# EAGLE design CANBed-FD M4 (EAGLE 6.4)
DESCRIPTION: microOBD 200 OBD-II Module; HW_REV: 1.4; PCB_REV: C; PCB_SPEC1: Layer Count: 4; PCB_SPEC2: Size: 1.3" x 0.59"; PCB_SPEC3: Finish Thickness: 0.049" - 0.052"; PCB_SPEC4: Copper Weight: 1oz; TITLE: STM1120

## Sheet 1 of 2
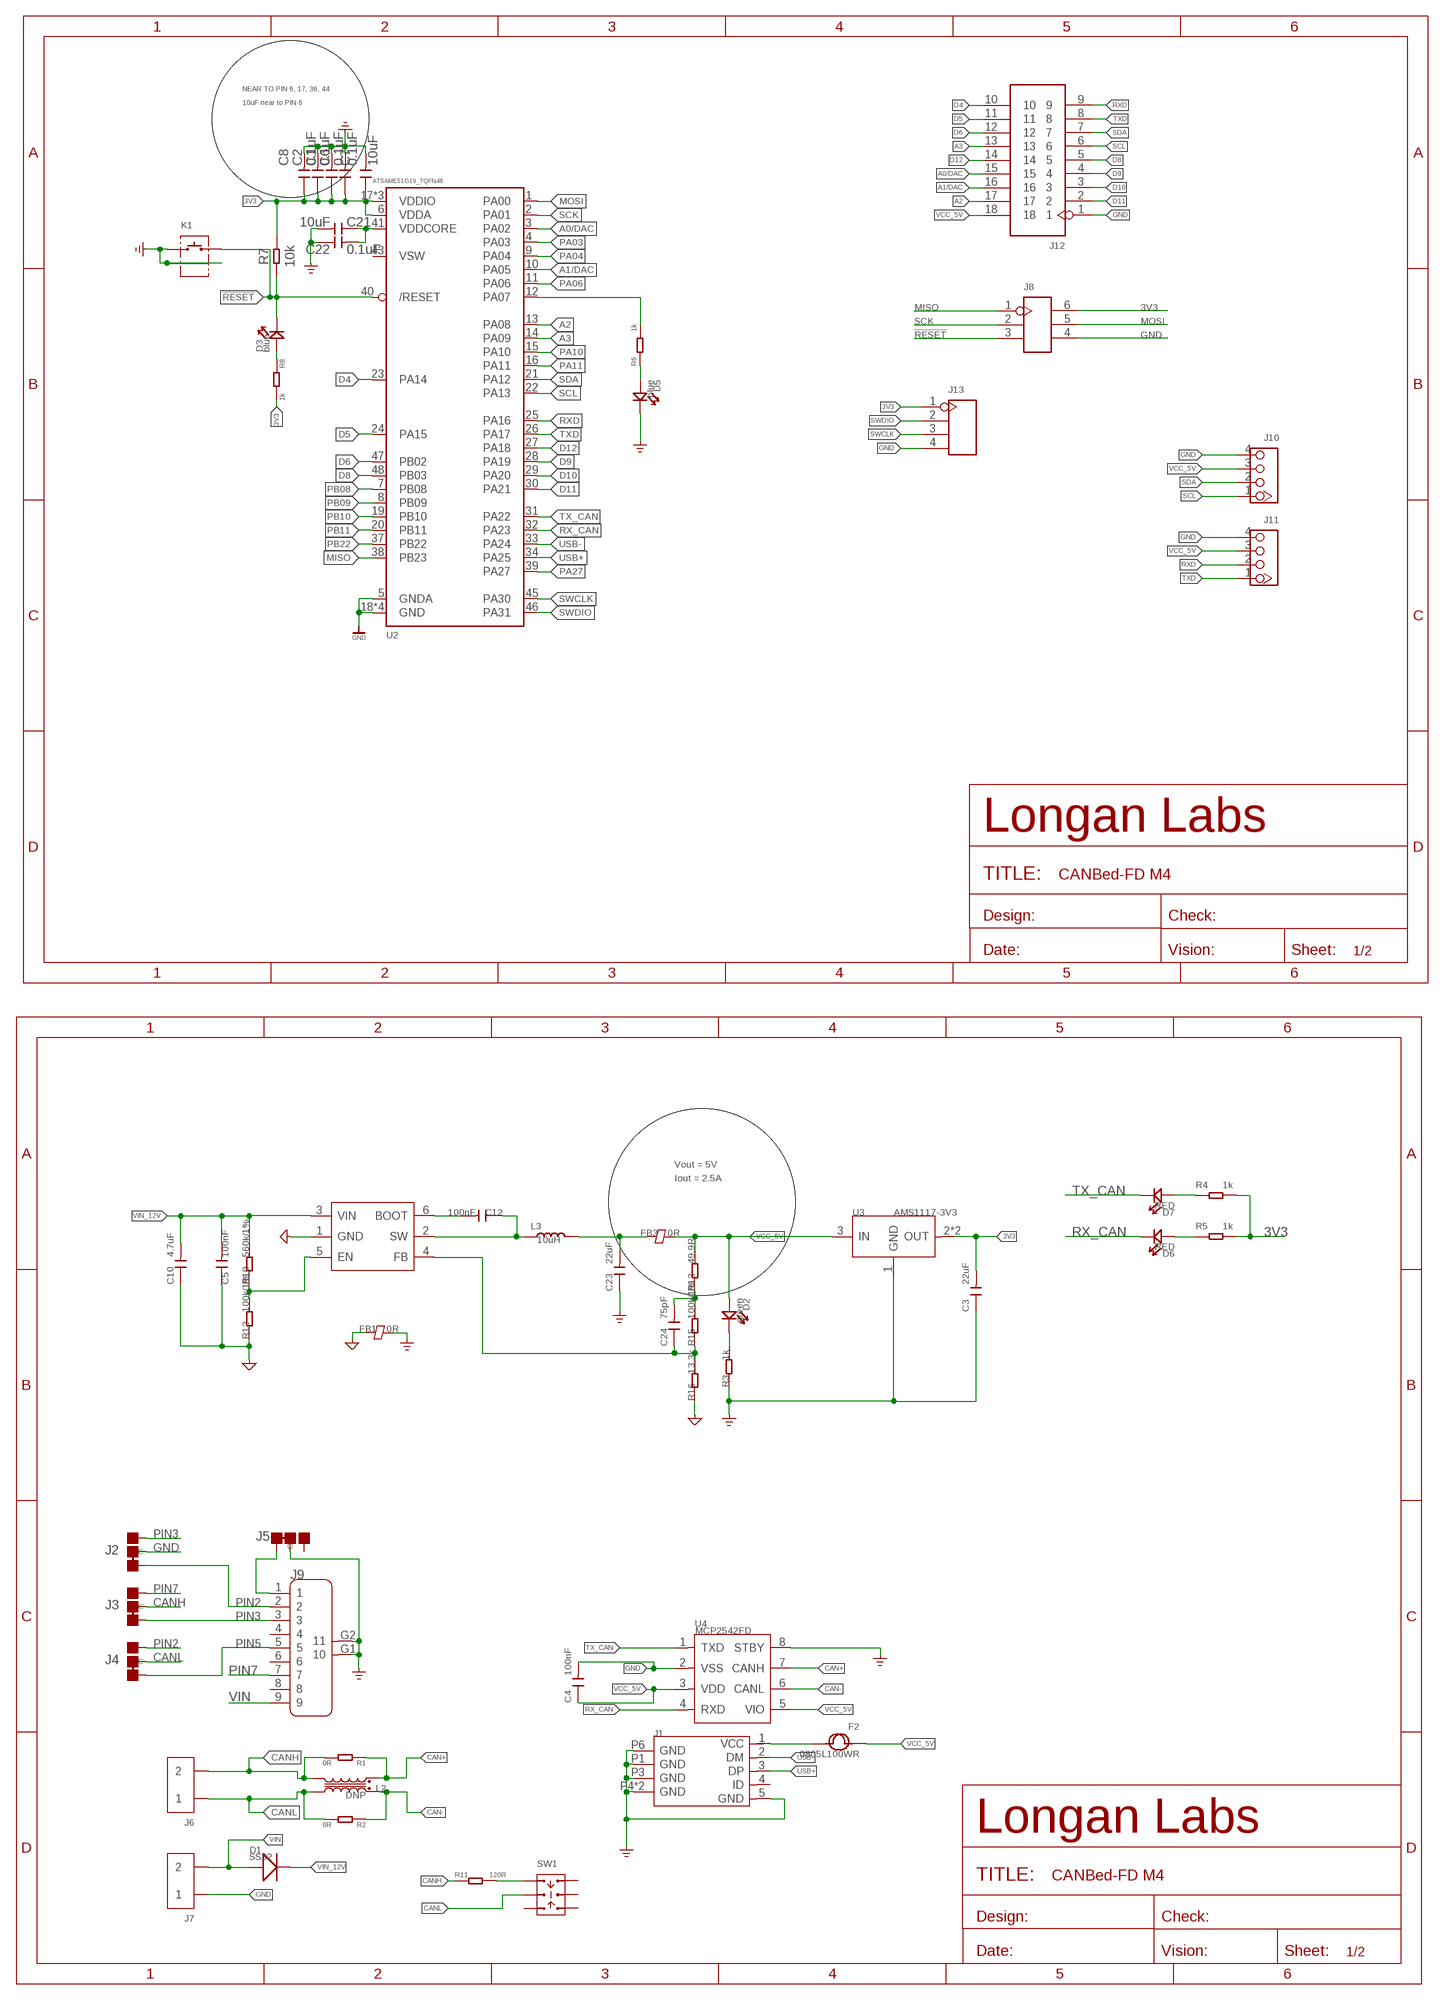
[diagram p0: schematic, sheet 1]

### Parts
C1  0.1uF  CAP-0603  [C0603]
C2  0.1uF  CAP-0603  [C0603]
C3  22uF  CAP-1206  [C1206]
C4  100nF  CAP-0603  [C0603]
C5  100nF  CAP-0603  [C0603]
C6  0.1uF  CAP-0603  [C0603]
C7  10uF  CAP-0603  [C0603]
C8  0.1uF  CAP-0603  [C0603]
C10  4.7uF  CAP-1206  [C1206]
C12  100nF  CAP-0603  [C0603]
C21  0.1uF  CAP-0603  [C0603]
C22  10uF  CAP-0603  [C0603]
C23  22uF  CAP-1206  [C1206]
C24  75pF  CAP-0603  [C0603]
D1  SS32  DIODE'SMA'  [DO-214AC]
D2  green  LED'0603'  [LED-0603]
D3  blue  LED'0603'  [LED-0603]
D5  blue  LED'0603'  [LED-0603]
D6  RED  LED'0603'  [LED-0603]
D7  RED  LED'0603'  [LED-0603]
F2  0805L100WR  FUSE0805  [F0805]
FB1  0R  FERRITE-BEAD-0805  [F0805]
FB3  0R  FERRITE-BEAD-0805  [F0805]
J1  MICRO-USB5+4P-320010050  [MICRO-USB5+5P-SMD-0.65-7.2X5.06MM]
J2  JUMPER-3P-SHORT  [3P-SMD-SHORT]
J3  JUMPER-3P-SHORT  [3P-SMD-SHORT]
J4  JUMPER-3P-SHORT  [3P-SMD-SHORT]
J5  JUMPER-3P-SHORT  [3P-SMD-SHORT]
J6  SCREW-TERMINAL-2P'5.08'  [H2-5.0-10.5X8.0MM]
J7  SCREW-TERMINAL-2P'5.08'  [H2-5.0-10.5X8.0MM]
J8  HEADER-2X3P-2.54  [H2X3-2.54]
J9  DB9'MEAL'  [DB9-MEAL]
J10  320110033  GROVE-CONNECTOR-DIP-2.0  [HW4-2.0]
J11  320110033  GROVE-CONNECTOR-DIP-2.0  [HW4-2.0]
J12  HEADER-2X9P-2.54  [H2X9-2.54]
J13  HEADER-4P-65/35MIL  [H4-2.54]
K1  BUTTON-2+2P  [SW2+2P-7.7X2.75X3.95MM]
L2  DNP  INDUCTOR-COMMON-MODE-SRF2012-900YA  [INT4-0.85-2X1.25X1.2MM]
L3  10uH  INDUCTOR-6.6X7.1  [INT2-SMD-6.6X7.1X3MM]
R1  0R  RES-0603  [R0603]
R2  0R  RES-0603  [R0603]
R3  1k  RES-0603  [R0603]
R4  1k  RES-0603  [R0603]
R5  1k  RES-0603  [R0603]
R6  1k  RES-0603  [R0603]
R7  10k  RES-0603  [R0603]
R8  1k  RES-0603  [R0603]
R10  560k/1%  RES-0603  [R0603]
R11  120R  RES-0603  [R0603]
R12  100k/1%  RES-0603  [R0603]
R13  49.9R  RES-0603  [R0603]
R15  100k/1%  RES-0603  [R0603]
R16  13.3k  RES-0603  [R0603]
SW1  SWITCH-2CH-6P-311010004  [SW6-2.54-9.0X3.5X3.2+2.0MM]
U1  PMIC-TPS54302  [SOT-23-6]
U2  ATSAME51G19_TQFN48  [TQFN48_7MM]
U3  AMS1117-3V3  PMIC-CJ1117S  [SOT-223]
U4  MCP2542FD  TRANSCEIVER-MCP2542  [SOIC8-1.27-5X4MM]

### Nets
3V3: C1.1 C2.1 C3.2 C6.1 C7.1 C8.1 J8.6 J13.1 R4.2 R5.2 R7.2 R8.2 U2.6(VDDA) U2.17(VDDIO) U2.36(VDDIO) U2.44(VDDIO) U3.2(OUT) U3.TER(OUT)
!RESET: D3.- J8.3 K1.2 R7.1 U2.40(/RESET)
A0/DAC: J12.15 U2.3(PA02)
A1/DAC: J12.16 U2.10(PA05)
A2: J12.17 U2.13(PA08)
A3: J12.13 U2.14(PA09)
AGND: C5.1 C10.1 FB1.1 R12.1 R16.1 U1.1(GND) ; supply symbol labelled GND_SIGNAL
CAN+: L2.4 R1.1 U4.7(CANH)
CAN-: L2.1 R2.1 U4.6(CANL)
CANH: J3.MM(C) J6.2 L2.3 R1.2 R11.1
CANL: J4.MM(C) J6.1 L2.2 R2.2 SW1.COM1
D4: J12.10 U2.23(PA14)
D5: J12.11 U2.24(PA15)
D6: J12.12 U2.47(PB02)
D8: J12.5 U2.48(PB03)
D9: J12.4 U2.28(PA19)
D10: J12.3 U2.29(PA20)
D11: J12.2 U2.30(PA21)
D12: J12.14 U2.27(PA18)
EXT_PWR: F2.2 J1.1(VCC)
GND: C1.2 C2.2 C3.1 C4.2 C6.2 C7.2 C8.2 C21.1 C22.2 C23.1 D5.- FB1.2 J1.5(GND) J1.P1(GND) J1.P3(GND) J1.P4(GND) J1.P5(GND) J1.P6(GND) J2.MM(C) J5.MM(C) J7.1 J8.4 J9.G1 J9.G2 J10.4 J11.4 J12.1 J13.4 K1.1 K1.S1 K1.S2 R3.1 U2.5(GNDA) U2.18(GND) U2.35(GND) U2.42(GND) U2.THERMAL(GND) U3.1(GND) U4.2(VSS) U4.8(STBY) ; supply symbol labelled GND_POWER
MISO: J8.1 U2.38(PB23)
MOSI: J8.5 U2.1(PA00)
N$1: D3.+ R8.1
N$2: D7.+ R4.1
N$3: D2.- R3.2
N$4: R10.1 R12.2 U1.5(EN)
N$5: C21.2 C22.1 U2.41(VDDCORE)
N$6: R6.2 U2.12(PA07)
N$8: D5.+ R6.1
N$11: C12.1 L3.1 U1.2(SW)
N$13: J5.11(L) J9.1
N$14: C12.2 U1.6(BOOT)
N$15: D6.+ R5.1
N$16: R11.2 SW1.CH1A
N$19: C23.2 FB3.1 L3.2
N$23: C24.2 R13.1 R15.2
N$26: C24.1 R15.1 R16.2 U1.4(FB)
PA03: U2.4(PA03)
PA04: U2.9(PA04)
PA06: U2.11(PA06)
PA10: U2.15(PA10)
PA11: U2.16(PA11)
PA27: U2.39(PA27)
PB08: U2.7(PB08)
PB09: U2.8(PB09)
PB10: U2.19(PB10)
PB11: U2.20(PB11)
PB22: U2.37(PB22)
PIN2: J2.11(L) J4.00(R) J9.2
PIN3: J2.00(R) J3.11(L) J9.3
PIN5: J4.11(L) J9.5
PIN7: J3.00(R) J9.7
RX_CAN: D6.- U2.32(PA23) U4.4(RXD)
RXD: J11.2 J12.9 U2.25(PA16)
SCK: J8.2 U2.2(PA01)
SCL: J10.1 J12.6 U2.22(PA13)
SDA: J10.2 J12.7 U2.21(PA12)
SWCLK: J13.3 U2.45(PA30)
SWDIO: J13.2 U2.46(PA31)
TX_CAN: D7.- U2.31(PA22) U4.1(TXD)
TXD: J11.1 J12.8 U2.26(PA17)
USB+: J1.3(DP) U2.34(PA25)
USB-: J1.2(DM) U2.33(PA24)
VCC_5V: C4.1 D2.+ F2.1 FB3.2 J10.3 J11.3 J12.18 R13.2 U3.3(IN) U4.3(VDD) U4.5(VIO)
VIN: D1.1(+) J7.2 J9.9
VIN_12V: C5.2 C10.2 D1.2(-) R10.2 U1.3(VIN)
Unconnected: J1.4(ID) J5.00(R) J9.4 J9.6 J9.8 SW1.CH1B SW1.CH2A SW1.CH2B SW1.COM2 U2.43(VSW)

### Notes on the sheet
- NEAR TO PIN 6, 17, 36, 44
- 10uF near to PIN 6
- Vout = 5V
- Iout = 2.5A

## Sheet 2 of 2

## Library data of the parts
C1-C8 C10 C12 C21-C24 = Discrete-new:CAP: Ceramic Capacitors
D1 = Discrete-new:DIODE*
D2 D3 D5-D7 = Discrete-new:LED
F2 = Discrete-small:FUSE
FB1 FB3 = Discrete-new:FERRITE-BEAD
J1 = Connector-new:MICRO-USB5+4P: 320010137:MICRO USB B型DIP 沉板0.7无卷边 -ST-USB-01H2 320010000:MICRO USB 5F CCHT 6.45(0.8X0.9) -ST-USB-001G 320010050:USB-MC-001-05 320010025:MICRO USB 5S AB TYPE DIP7.2
J2-J5 = Discrete-new:JUMPER-3P-SHORT
J6 J7 = Connector-new:SCREW-TERMINAL-2P: 2P-3.5:320110028;2P-5.0:320110031
J8 = Connector-new:HEADER-2X3P
J9 = Connector:DB9
J10 J11 = Connector-new:GROVE-CONNECTOR-DIP: 4P-2.0:320110033;4P-2.0-90D:320110034
J12 = Connector-new:HEADER-2X9P
J13 = Connector-new:HEADER-4P
K1 = Connector-new:BUTTON-2+2P
L2 = Discrete-new:INDUCTOR-COMMON-MODE
L3 = Discrete-new:INDUCTOR
R1-R8 R10-R13 R15 R16 = Discrete-new:RES
SW1 = Switch:SWITCH-2CH-6P
U1 = IC-new:PMIC-TPS54302
U2 = MyLibrary:ATSAME51G19; MPN: ATSAME51G19A-MF
U3 = IC-new:PMIC-CJ*1117: Low Drop Fixed And Adjustable Positive Voltage Regulators http://www.datasheetcatalog.org/datasheet/SGSThomsonMicroelectronics/mXuqtqv.pdf
U4 = untitled:TRANSCEIVER-MCP2542

## Net classes
0 default: width 0.152 mm, drill 0.254 mm, clearance 0.152 mm
1 can: width 0.152 mm, drill 0.254 mm, clearance 0.152 mm
2 USB: width 0.102 mm, clearance 0.076 mm
3 usbvcc: width 0.152 mm, drill 0.152 mm, clearance 0.152 mm

## Board
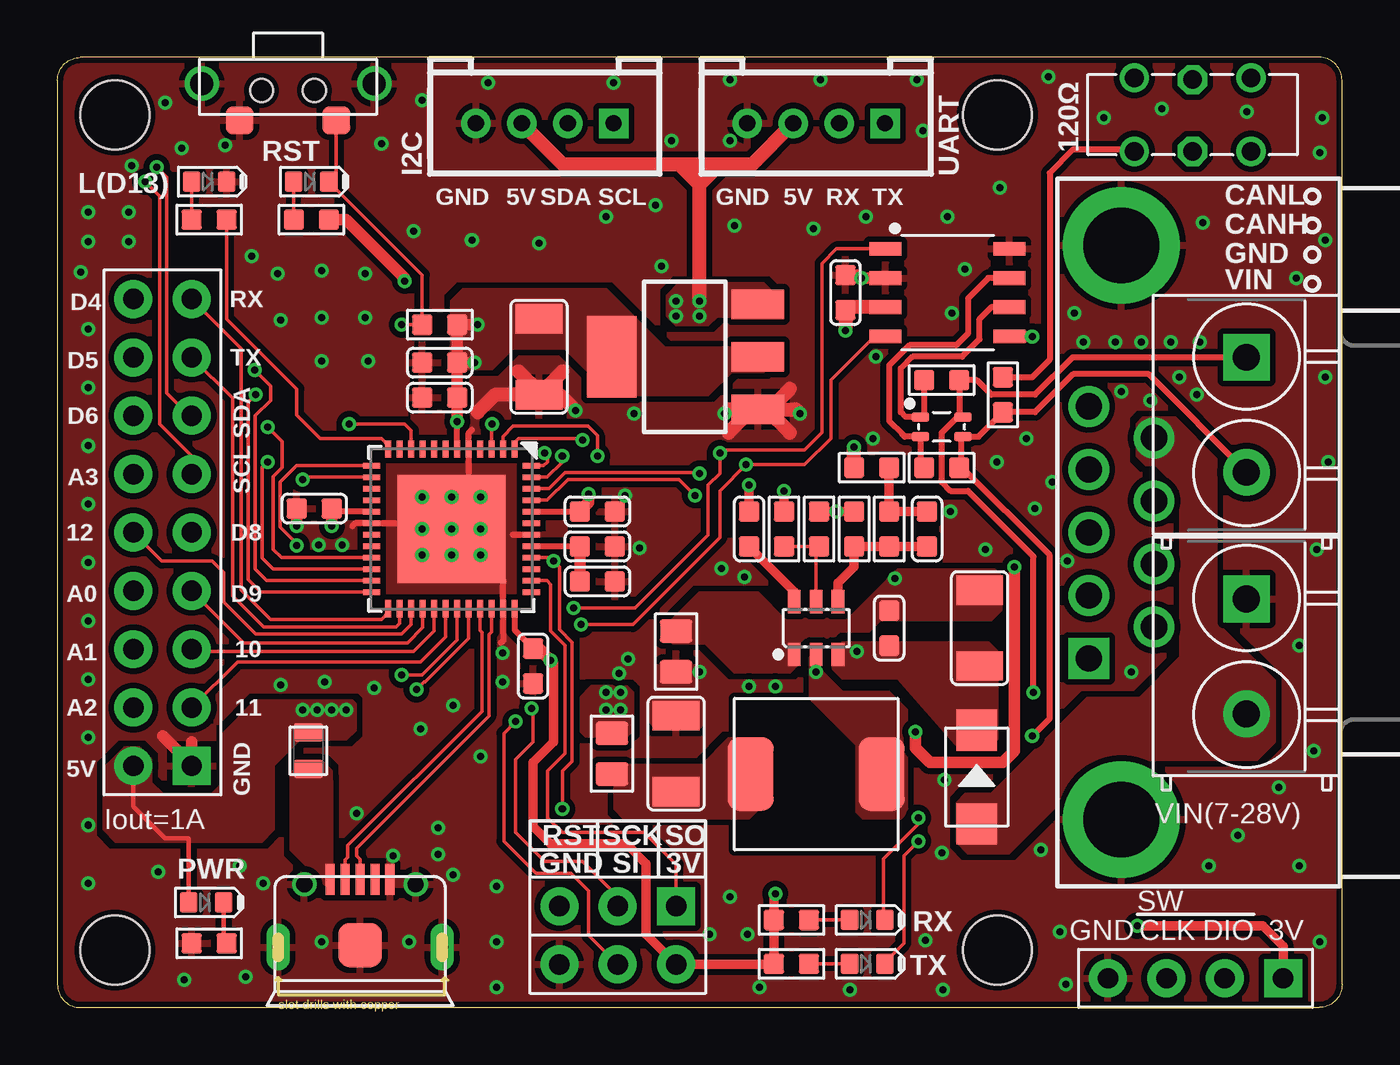
[diagram p1: board, top side]
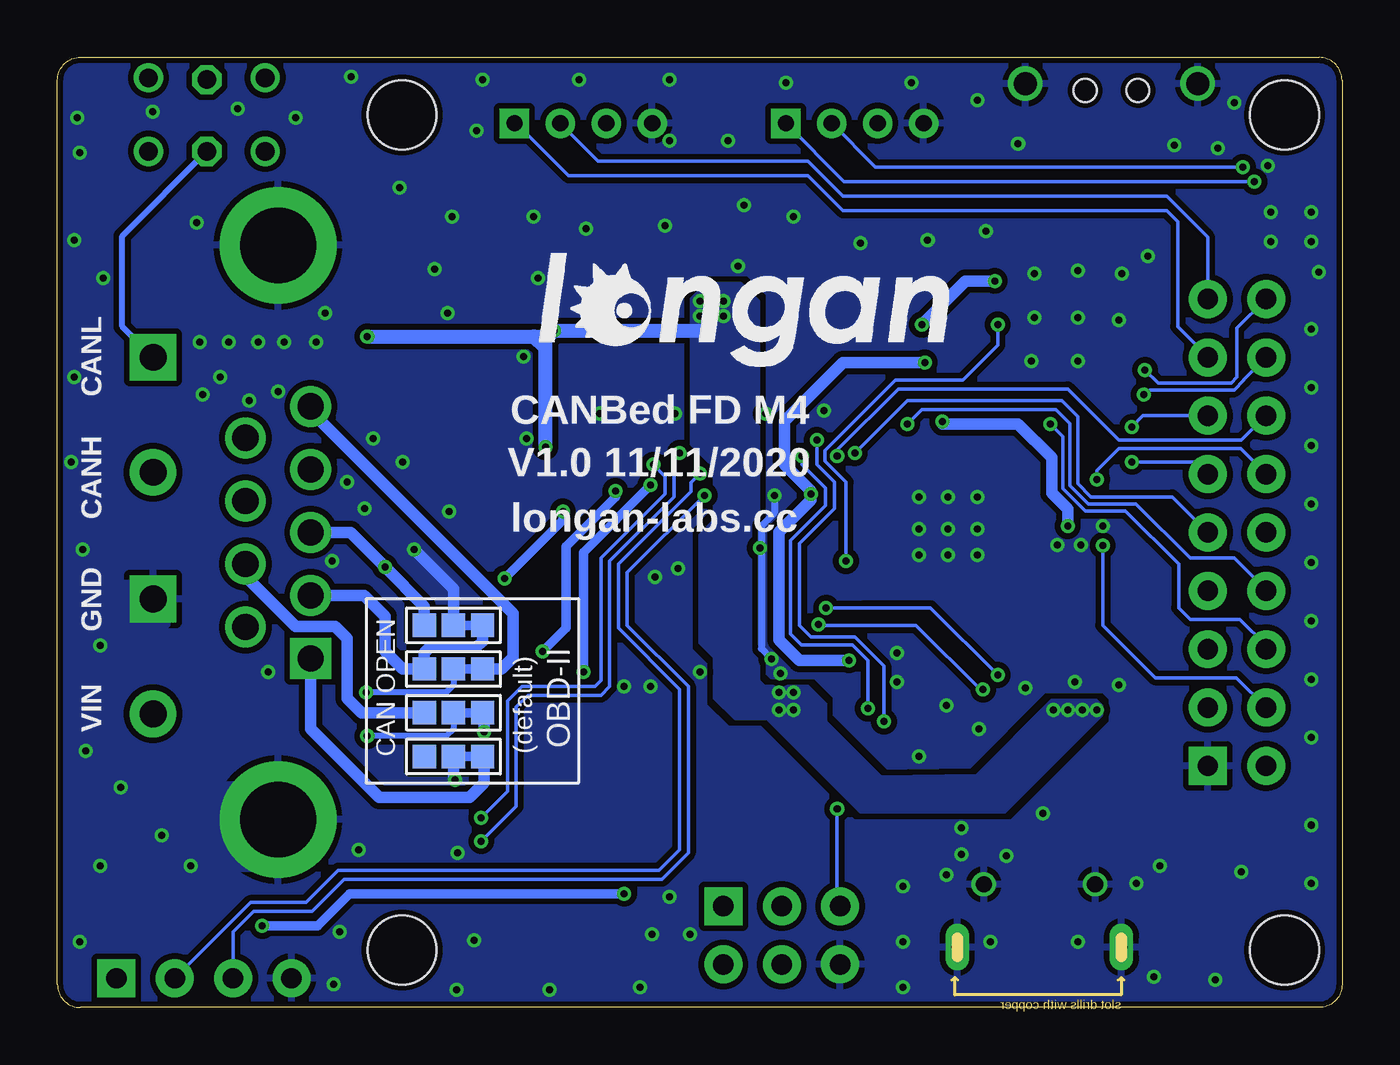
[diagram p2: board, bottom side, seen from below]

Size 55.91 x 41.35 mm. Coordinates in mm from the lower left corner, seen from the top.
Outline: 1,0 54.91,0 arc90 55.91,1 55.91,40.35 arc84 55.01,41.35 1,41.35 arc90 0,40.35 0,1 arc90 1,0
Copper layers (1*16): Top 0.035mm / dielectric 1.5mm / Bottom 0.035mm
Design rules "SeeedStudio_2layer_DRU_no_angle_20140221 *": minimum track width 1mil, minimum drill 10mil, track to track 6mil, track to pad 6mil, pad to pad 6mil, via to via 6mil, smd to smd 0mil, copper to edge 10mil, drill to drill 10mil, minimum pad ring 4mil, minimum via ring 4mil, stop-mask expansion 2mil, vias tented up to drill 25mil, thermal gap 10mil
Holes 3 mm at 2.5,38.85 2.5,2.5 40.91,38.85 40.91,2.5
tRestrict: area 29.5,12.1 to 32.4,13.5; area 29.5,6.9 to 36.6,7.9

### Footprints (pad centres in the part's own frame; a part is rotated, then mirrored left to right if it is on the bottom)
C0603 = smd 0.889 x 0.889: 1 -0.762,0; 2 0.762,0
C1206 = smd 1.27 x 2.032: 1 -1.651,0; 2 1.651,0
DO-214AC = smd 1.8 x 1.77: 1 -2.042,0; 2 2.042,0
LED-0603 = smd 0.762 x 0.889: + 0.762,0; - -0.762,0
F0805 = smd 0.819 x 1.27: 1 -0.79,0; 2 0.79,0
F0805' = smd 1.016 x 1.397: 1 -0.889,0; 2 0.889,0
MICRO-USB5+5P-SMD-0.65-7.2X5.06MM = smd 0.4 x 1.35: 1 -1.3,2.875; 2 -0.65,2.875; 3 0,2.875; 4 0.65,2.875; 5 1.3,2.875 | smd 1.9 x 1.9: P1 0,0 | drill 0.508 pad 1.016 long: P3 -3.575,-0.08; P4 3.575,-0.08 | drill 0.7: P5 -2.425,2.65; P6 2.425,2.65
3P-SMD-SHORT = smd 1.016 x 1.016: 00 -1.27,0; 11 1.27,0; MM 0,0
H2-5.0-10.5X8.0MM = drill 1.168 pad 2.032 square: 1 0,2.5 | drill 1.168 pad 2.032: 2 0,-2.5
H2X3-2.54 = drill 0.889 pad 1.651 square: 1 -1.27,2.54 | drill 0.889 pad 1.651: 2 -1.27,0; 3 -1.27,-2.54; 4 1.27,-2.54; 5 1.27,0; 6 1.27,2.54
DB9-MEAL = drill 1.143 pad 1.778 square: 1 -5.486,1.422 | drill 1.143 pad 1.778: 2 -2.743,1.422; 3 0,1.422; 4 2.743,1.422; 5 5.486,1.422; 6 -4.115,-1.422; 7 -1.372,-1.422; 8 1.372,-1.422; 9 4.115,-1.422 | drill 3.302 pad 5.08: G1 12.497,0; G2 -12.497,0
HW4-2.0 = drill 0.7 pad 1.27 square: 1 -3,0 | drill 0.7 pad 1.27: 2 -1,0; 3 1,0; 4 3,0
H2X9-2.54 = drill 0.889 pad 1.651 square: 1 -1.27,10.16 | drill 0.889 pad 1.651: 2 -1.27,7.62; 3 -1.27,5.08; 4 -1.27,2.54; 5 -1.27,0; 6 -1.27,-2.54; 7 -1.27,-5.08; 8 -1.27,-7.62; 9 -1.27,-10.16; 10 1.27,-10.16; 11 1.27,-7.62; 12 1.27,-5.08; 13 1.27,-2.54; 14 1.27,0; 15 1.27,2.54; 16 1.27,5.08; 17 1.27,7.62; 18 1.27,10.16
H4-2.54 = drill 0.889 pad 1.651 square: 1 0,3.81 | drill 0.889 pad 1.651: 2 0,1.27; 3 0,-1.27; 4 0,-3.81
SW2+2P-7.7X2.75X3.95MM = smd 1.2 x 1.2: 1 -2.1,0; 2 2.1,0 | drill 1 pad 1.5: S1 -3.75,1.6; S2 3.75,1.6 | hole 1: -1.15,1.3; 1.15,1.3
INT4-0.85-2X1.25X1.2MM = smd 0.4 x 0.75: 1 -0.425,-0.925; 2 -0.425,0.925; 3 0.425,0.925; 4 0.425,-0.925
INT2-SMD-6.6X7.1X3MM = smd 2 x 3.2: 1 -2.85,0; 2 2.85,0
R0603 = smd 0.889 x 0.889: 1 -0.762,0; 2 0.762,0
SW6-2.54-9.0X3.5X3.2+2.0MM = drill 0.813 pad 1.27: CH1A -2.54,-1.6; CH1B 2.54,-1.6; CH2A -2.54,1.6; CH2B 2.54,1.6 | drill 0.813 pad 1.27 octagon: COM1 0,-1.6; COM2 0,1.524
SOT-23-6 = smd 0.55 x 1.016: 1 -0.95,-1.143; 2 0,-1.143; 3 0.95,-1.143; 4 0.95,1.143; 5 0,1.143; 6 -0.95,1.143
TQFN48_7MM = smd 0.25 x 0.75: 1 -2.75,-3.475; 2 -2.25,-3.475; 3 -1.75,-3.475; 4 -1.25,-3.475; 5 -0.75,-3.475; 6 -0.25,-3.475; 7 0.25,-3.475; 8 0.75,-3.475; 9 1.25,-3.475; 10 1.75,-3.475; 11 2.25,-3.475; 12 2.75,-3.475; 25 2.75,3.475; 26 2.25,3.475; 27 1.75,3.475; 28 1.25,3.475; 29 0.75,3.475; 30 0.25,3.475; 31 -0.25,3.475; 32 -0.75,3.475; 33 -1.25,3.475; 34 -1.75,3.475; 35 -2.25,3.475; 36 -2.75,3.475 | smd 0.75 x 0.25: 13 3.475,-2.75; 14 3.475,-2.25; 15 3.475,-1.75; 16 3.475,-1.25; 17 3.475,-0.75; 18 3.475,-0.25; 19 3.475,0.25; 20 3.475,0.75; 21 3.475,1.25; 22 3.475,1.75; 23 3.475,2.25; 24 3.475,2.75; 37 -3.475,2.75; 38 -3.475,2.25; 39 -3.475,1.75; 40 -3.475,1.25; 41 -3.475,0.75; 42 -3.475,0.25; 43 -3.475,-0.25; 44 -3.475,-0.75; 45 -3.475,-1.25; 46 -3.475,-1.75; 47 -3.475,-2.25; 48 -3.475,-2.75 | smd 4.7 x 4.7: THERMAL 0,0
SOT-223 = smd 1.27 x 2.286: 1 -2.286,-3.175; 2 0,-3.175; 3 2.286,-3.175 | smd 3.556 x 2.159: TER 0,3.175
SOIC8-1.27-5X4MM = smd 0.6 x 1.4: 1 -1.905,-2.7; 2 -0.635,-2.7; 3 0.635,-2.7; 4 1.905,-2.7; 5 1.905,2.7; 6 0.635,2.7; 7 -0.635,2.7; 8 -1.905,2.7

### Placement (x,y rotation side)
C1  11.18,21.72 180 top
C2  20.7,14.86 270 top
C3  20.95,28.32 90 top
C4  34.29,31.11 90 top
C5  36.2,16.51 270 top
C6  16.64,26.54 180 top
C7  16.64,28.07 180 top
C8  23.5,21.59 0 top
C10  40.13,16.51 270 top
C12  30.1,20.83 270 top
C21  23.5,20.07 180 top
C22  23.5,18.54 0 top
C23  26.92,11.05 270 top
C24  37.85,20.83 90 top
D1  40.01,10.03 90 top
D2  6.48,4.57 180 top
D3  11.05,35.94 180 top
D5  6.6,35.94 180 top
D6  35.24,3.81 180 top
D7  35.24,1.91 180 top
F2  10.92,11.18 270 top
FB1  0R  [F0805']  26.92,15.49 270 top
FB3  0R  [F0805']  24.13,11.05 90 top
J1  13.17,2.71 0 top
J2  38.67,16.64 0 bottom
J3  38.67,12.83 0 bottom
J4  38.67,14.73 0 bottom
J5  38.67,10.92 0 bottom
J6  51.75,25.8 0 top
J7  51.75,15.28 0 top
J8  24.38,3.14 270 top
J9  46.31,20.68 90 top
J10  21.21,38.48 180 top
J11  33.02,38.48 180 top
J12  4.57,20.68 180 top
J13  49.53,1.27 270 top
K1  10.03,38.61 0 top
L2  38.48,25.27 270 top
L3  33.02,10.16 180 top
R1  38.48,23.5 0 top
R2  38.48,27.3 0 top
R3  6.6,2.79 0 top
R4  31.94,1.91 180 top
R5  31.94,3.81 180 top
R6  6.6,34.29 0 top
R7  16.64,29.72 0 top
R8  11.05,34.29 0 top
R10  31.62,20.83 90 top
R11  41.15,26.67 90 top
R12  33.15,20.83 270 top
R13  35.43,23.5 180 top
R15  36.2,20.83 90 top
R16  34.67,20.83 270 top
SW1  49.4,38.86 0 top
U1  33.02,16.51 0 top
U2  17.14,20.83 180 top
U3  27.3,28.32 90 top
U4  38.73,31.11 270 top
U$12  [LONGAN-SILK-SMALL]  36.58,26.42 0 bottom

### Tracks (layer width: path | path; a pad name or v marks a point on that pad's centre or on a via)
3V3  (via drill 0.3 pad 0.61)
  Top 0.254: U2.17 12.08,21.58 C1.1 | U2.36 19.89,16.43 C2.1 | U2.44 22.72,21.58 C8.1 | C6.1 | U2.6 v17.39,25.5 v17.4,25.5
  Top 0.406: v31.24,4.95 31.18,4.89 R5.2 R4.2 31.14,1.87 J8.6 25.62,3.17 25.62,6.26 24.77,7.11 21.46,7.11 20.7,7.87 20.7,10.67 21.59,11.56 21.59,14.99 v21.46,15.11 | v46.99,3.56 52.45,3.56 53.34,2.67 J13.1
  Top 0.508: C6.1 C7.1 | C8.1 23.11,21.97 v23.11,22.35 | C7.1 v18.16,28.07 | C1.1 v11.94,20.95 | v15.11,31.62 15.11,31.75 12.57,34.29 R8.2 | v18.29,29.72 R7.2 C7.1 | v17.4,25.5 v17.39,25.51 C6.1 | C2.1 20.95,15.62 v21.46,15.11
  Bottom 0.406: v31.24,4.95 43.18,4.95 44.58,3.56 v46.99,3.56
  Bottom 0.508: v18.16,28.07 21.72,28.07 24.26,25.53 24.26,23.62 23.11,22.48 v23.11,22.35 23.11,22.1 24.51,20.7 24.51,16.38 24.51,16 23.62,15.11 v21.46,15.11 | v15.11,31.62 16.38,31.62 v18.29,29.72 | v11.94,20.95 11.94,21.7 12.62,22.38 12.62,23.93 14.1,25.4 17.4,25.4 v17.4,25.5
  pour Top (isolate 0.254, no thermals): 30.86,28.7 26.42,28.7 23.88,31.24 17.65,31.24 17.14,30.73 17.14,28.19 17.53,27.81 18.92,27.81 19.81,28.7 22.1,28.7 24.13,26.67 28.32,26.67 29.34,27.69 30.73,27.69 30.99,27.94 30.99,28.57
!RESET  (via drill 0.3 pad 0.61)
  Top 0.152: v21.97,8.64 21.97,10.29 22.4,10.72 22.4,15.89 21.84,16.45 21.84,19.18 v21.59,19.43 21.44,19.58 U2.40 | v14.99,29.72 R7.1 15.88,31.88 D3.- 12.13,36.26 K1.2
  Bottom 0.152: v21.97,8.64 21.97,4.57 21.84,4.44 J8.3 | v14.99,29.72 14.99,28.83 16.51,27.3 19.43,27.3 22.5,24.23 22.5,23.78 21.59,22.87 v21.59,19.43
A0/DAC  (via drill 0.3 pad 0.61)
  Top 0.152: U2.3 18.89,25.37 v18.92,25.4
  Bottom 0.152: J12.15 3.3,18.16 4.7,19.56 6.6,19.56 8.97,21.92 11.05,21.92 11.84,22.71 11.84,25.43 12.45,26.04 18.29,26.04 v18.92,25.4
A1/DAC  (via drill 0.3 pad 0.61)
  Top 0.152: U2.10 15.39,25.12 15.11,25.4 v12.7,25.4
  Bottom 0.152: J12.16 3.3,15.75 4.45,16.89 6.6,16.89 7.11,17.4 7.11,19.3 9.42,21.61 11.18,21.61 12.14,22.58 12.14,24.84 v12.7,25.4
A2  (via drill 0.3 pad 0.61)
  Top 0.152: U2.13 10.42,23.58 9.7,22.86 9.7,20.9 10.41,20.19 v10.41,20.11
  Bottom 0.152: v10.41,20.11 10.41,16.64 8.13,14.35 4.6,14.35 J12.17
A3  (via drill 0.3 pad 0.61)
  Top 0.152: U2.14 10.76,23.08 v10.67,22.99
  Bottom 0.152: J12.13 4.41,24.32 9.72,24.32 10.67,23.37 v10.67,22.99
AGND  (via drill 0.3 pad 0.61)
  Top 0.406: R16.1 v33.91,21.59 R12.1
  Bottom 0.406: v33.91,21.59 33.91,21.21 v36.45,18.67
  pour Top (isolate 0.254, no thermals): 40.77,19.05 36.58,19.05 34.42,16.89 31.62,16.89 30.48,18.03 27.94,18.03 26.42,16.51 26.42,16.26 26.8,15.88 28.19,15.88 29.46,14.61 31.88,14.61 32.26,14.99 32.26,15.88 32.51,16.13 33.78,16.13 34.04,16.38 35.31,16.38 35.81,16.89 40.64,16.89 41.15,17.4 41.15,18.67
CAN+
  Top 0.254: U4.7 40.51,31.75 39.62,30.86 39.62,29.34 39.12,28.83 37.08,28.83 36.2,27.94 36.2,25.53 36.77,24.96 36.83,24.89 36.87,24.85 L2.4 37.56,23.66 R1.1
CAN-
  Top 0.254: U4.6 40.64,30.48 40.13,29.97 40.13,29.08 39.37,28.32 37.21,28.32 36.7,27.81 36.7,25.91 36.91,25.7 L2.1 37.72,25.86 R2.1
CANH  (via drill 0.3 pad 0.61)
  Top 0.254: J6.2 47.5,27.56 44.2,27.56 42.55,25.91 R11.1 40.09,24.85 L2.3 39.33,24.85 39.33,23.58 | 39.33,23.58 R1.2 | v42.42,11.81 43.18,12.57 43.18,19.68 39.33,23.54 39.33,23.58
  Bottom 0.254: J3.MM 38.67,12.13 38.99,11.81 v42.42,11.81
CANL  (via drill 0.3 pad 0.61)
  Top 0.254: J6.1 44.17,28.3 42.55,26.67 40.64,26.67 40.01,27.3 R2.2 39.24,25.86 L2.2 39.16,25.7 38.48,25.02 38.48,22.86 38.86,22.48 39.62,22.48 42.48,19.62 v42.48,13.72
  Bottom 0.254: J4.MM 38.67,14.03 38.99,13.72 v42.48,13.72 | J6.1 53.09,29.64 53.09,33.58 SW1.COM1
D4  (via drill 0.3 pad 0.61)
  Top 0.152: U2.23 9.11,18.58 8.61,19.07 8.61,25.76 9.27,26.42 9.27,27.05 v8.57,27.75
  Bottom 0.152: J12.10 4.57,29.57 4.57,27.43 4.83,27.18 8,27.18 v8.57,27.75
D5  (via drill 0.3 pad 0.61)
  Top 0.152: U2.24 8.85,18.08 8.31,18.62 8.31,26.34 v8.64,26.67
  Bottom 0.152: v8.64,26.67 8.58,26.67 8.37,26.87 4.7,26.87 4.27,27.31 4.27,27.33 J12.11
D6  (via drill 0.3 pad 0.61)
  Top 0.152: U2.47 21.3,23.08 21.97,23.75 v21.97,24
  Bottom 0.152: J12.12 3.33,25.75 4.39,24.7 9.72,24.7 11.94,26.92 19.3,26.92 21.97,24.26 v21.97,24
D8  (via drill 0.3 pad 0.61)
  Top 0.152: U2.48 21.16,23.58 21.34,23.75 21.34,24 v21.21,24.13
  Bottom 0.152: v21.21,24.13 18.92,26.42 12.19,26.42 11.49,25.72 11.49,22.8 10.92,22.23 7.39,22.23 J12.5
D9
  Top 0.152: U2.28 15.89,16.53 15.24,15.88 8.1,15.88 J12.4
D10
  Top 0.152: U2.29 16.39,16.39 15.49,15.49 5.94,15.49 J12.3
D11
  Top 0.152: U2.30 16.89,16.13 15.81,15.05 7.84,15.05 J12.2
D12
  Top 0.152: U2.27 15.39,16.66 14.99,16.26 8.64,16.26 7.24,17.65 7.24,18.92 6.73,19.43 4.55,19.43 J12.14
EXT_PWR
  pour Top (isolate 0.254, no thermals): 11.81,5.21 10.16,6.86 10.16,10.16 10.67,10.67 11.54,10.67 11.92,10.3 11.94,9.53 11.94,5.33
GND  (via drill 0.3 pad 0.61)
  Top 0.254: 18.03,25.15 17.89,25.01 U2.5 17.89,23.25 17.91,23.24 | U2.42 19.81,20.57 | 15.49,20.95 15.37,21.08 U2.18 12.95,21.08 12.83,20.95 | 19.3,15.88 19.39,15.97 U2.35 19.39,18.51 19.43,18.54
  Top 0.508: C4.2 34.86,31.88 v34.99,31.75 | U4.2 35.05,31.75 | 5.84,11.56 J12.1 5.84,10.54 4.57,11.81 | C1.2 v10.41,20.95
  Top 0.61: C3.1 21.84,26.67 v22.54,25.97 | U3.1 29.21,26.04 v29.02,25.84 | U3.1 30.86,26.04 | 30.86,26.04 30.99,26.04 | 30.99,26.04 32.13,26.04 v32.32,25.84 | C3.1 19.05,26.67 18.29,25.91 | C3.1 21.97,27.69 | C3.1 20.95,26.8 20.07,27.69 | 30.99,26.04 31.88,26.92 | U3.1 30.23,26.04 29.21,25.02 | 30.86,26.04 31.88,25.02
  Bottom 0.305: v24.7,22.29 24.7,21.53 25.27,20.95 25.27,15.62 24.89,15.24
  Bottom 0.508: J5.MM 38.67,9.97 v38.61,9.91 | J2.MM 38.67,18.22 v40.39,19.94
  other vias: 14.61,6.6 37.66,38.16 7.3,37.53 5.4,37.4 3.24,36.64 1.33,34.61 1.33,7.94 1.33,5.4 4.38,5.91 8.95,5.4 11.49,2.86 15.3,2.86 19.11,2.86 16.57,6.67 17.21,5.78 19.11,0.89 30.54,0.89 34.48,0.76 37.78,2.92 30.04,3.17 29.27,4.83 54.04,15.75 55.31,23.75 53.91,31.75 55.18,33.4 54.93,37.21 48.07,39.12 49.85,34.16 45.53,38.73 35.5,24.77 29.27,37.72 26.73,37.72 44.26,30.23 49.72,28.96 38.86,21.59 43.31,22.86 29.27,40.39 37.4,40.39 33.21,40.39 24.19,40.26 18.73,40.26 38.93,30.23 48.45,28.96 47.18,28.96 46.04,28.96 44.64,28.96 46.29,26.8 47.56,26.42 48.83,27.43 49.59,26.67 38.73,34.42 41.02,35.69 26.04,34.92 23.88,34.42 15.49,33.78 14.1,37.59 15.88,39.5 4.7,39.37 1.02,32 26.29,32.26 39.5,32.13 7.94,6.16 5.52,1.21 8.19,1.33 1.33,11.75 1.33,14.29 1.33,16.83 1.33,19.37 1.33,21.91 1.33,24.45 1.33,26.99 1.33,29.53 1.33,33.34 38.54,0.76 43.88,1.02 43.62,3.3 42.16,24.77 40.89,23.75 42.55,21.72 51.75,38.99 55.05,38.73 43.12,40.51 3.11,34.61 3.11,33.34 38.48,6.73 42.8,6.86 31.24,13.97 30.1,13.97 28.38,3.17 54.67,11.18 51.37,7.49 53.15,9.59 50.1,6.16 54.04,6.16 54.93,2.86 54.8,19.94 55.18,27.43 35.18,34.42 35.62,28.32 43.94,19.43 46.74,14.61 27.94,14.61 24.83,15.18 18.41,10.92 24.45,14.54 19.37,14.16 19.37,15.43 17.14,20.83 18.41,20.83 15.88,20.83 15.88,22.23 17.14,22.23 18.41,22.23 18.41,19.68 17.14,19.68 15.88,19.68 25.34,20 28.89,19.11 15.81,12.13 17.21,13.14 13.78,13.91 11.62,14.16 9.72,14.03 13.02,8.45 16.57,7.81 19.11,5.27 13.53,28.13 11.49,28.13 11.49,30.04 13.4,30.04 13.4,31.94 11.49,32.07 9.59,31.94 9.72,29.91 8.45,32.7 18.03,33.4 20.95,33.27 29.46,34.04 32.89,33.91 29.91,18.73 11.37,20.13 12.38,20.13 25.08,25.84
  pour Bottom (isolate 0.254, no thermals): 52.07,18.54 54.48,18.54 54.99,18.03 54.99,7.62 53.34,5.97 45.21,5.97 44.58,6.6 44.58,9.02 45.34,9.78 51.94,9.78 53.09,10.92 53.09,14.61 51.05,16.64 51.05,18.29 51.31,18.54
  pour Top (isolate 0.254, rank 6): -0.64,41.91 56.52,41.91 56.52,-0.64 -0.64,-0.64
  pour Bottom (isolate 0.254, rank 6): -0.64,41.91 56.52,41.91 56.52,-0.64 -0.64,-0.64
  pour Top (isolate 0.254, no thermals): 26.8,14.86 28.19,14.86 28.45,14.61 28.45,12.7 27.94,12.19 26.04,12.19 25.65,12.57 25.65,14.48 26.04,14.86
MISO
  Top 0.152: J8.1 26.92,6.22 25.53,7.62 21.97,7.62 21.34,8.26 21.34,10.29 22.1,11.05 22.1,15.75 21.46,16.38 21.46,18.41 21.3,18.58 U2.38
MOSI  (via drill 0.3 pad 0.61)
  Top 0.152: U2.1 19.89,24.59 20.07,24.77 22.8,24.77 v22.86,24.7 | J8.5 23.11,3.14 23.11,5.08 22.35,5.84 20.83,5.84 19.43,7.24 19.43,11.94 v19.94,12.45
  Bottom 0.152: v19.94,12.45 19.94,14.86 21.21,16.13 23.11,16.13 23.62,16.64 23.62,20.19 22.1,21.72 22.1,22.86 22.86,23.62 v22.86,24.7
N$1
  Top 0.152: R8.1 D3.+
N$2
  Top 0.152: D7.+ R4.1
N$3
  Top 0.203: D2.- 7.24,2.92 R3.2
N$4
  Top 0.152: U1.5 33.02,19.94 R12.2 R10.1
N$5
  Top 0.254: U2.41 C21.2
  Top 0.508: C21.2 C22.1
N$6
  Top 0.152: U2.12 14.39,24.47 14.1,24.77 11.43,24.77 10.41,25.78 10.41,26.92 7.37,29.97 R6.2
N$8
  Top 0.152: R6.1 D5.+
N$11  (via drill 0.3 pad 0.61)
  Top 0.406: U1.2 v33.02,14.61 | C12.1 v30.1,22.73
  Bottom 0.406: v33.02,14.61 33.02,19.81 v30.1,22.73
  pour Top (isolate 0.254, no thermals): 33.02,15.37 33.15,15.24 33.15,14.73 34.16,13.72 36.2,13.72 36.96,12.95 36.96,8.51 36.7,8.26 35.05,8.26 34.8,8.51 34.8,11.43 32.77,13.46 32.77,15.24 32.89,15.37
N$13
  Bottom 0.508: J5.11 37.34,10.86 37.34,9.78 37.97,9.14 41.91,9.14 44.88,12.12 J9.1
N$14
  Top 0.406: U1.6 32.07,18.09 C12.2
N$15
  Top 0.152: D6.+ R5.1
N$16
  Top 0.254: SW1.CH1A 46.79,37.34 44.2,37.34 43.18,36.32 43.18,28.19 42.42,27.43 R11.2
N$19
  pour Top (isolate 0.254, no thermals): 30.23,11.68 29.21,11.68 28.07,10.54 24.64,10.54 24.26,10.16 24.26,8.64 24.64,8.26 30.1,8.26 30.86,9.02 30.86,11.05
N$23
  Top 0.406: C24.2 R15.2 R13.1
N$26
  Top 0.406: U1.4 33.97,18.48 34.67,19.18 R16.2 36.07,20.07 36.2,19.94 R15.1 C24.1
PIN2
  Bottom 0.508: J2.11 37.4,15.94 37.66,15.68 39.69,15.68 39.94,15.43 J4.00 40.89,14.73 41.66,15.49 41.66,17.02 42.57,17.93 J9.2
PIN3  (via drill 0.3 pad 0.61)
  Top 0.508: v41.66,19.18 41.66,11.18 41.15,10.67 37.97,10.67 37.34,11.3 v37.34,12
  Bottom 0.508: J2.00 39.94,17.46 v41.66,19.18 43.15,20.68 J9.3 | v37.34,12 37.34,12.76 J3.11
PIN5
  Bottom 0.508: J9.5 44.88,25.96 36.07,17.14 36.07,15.24 36.58,14.73 J4.11
PIN7
  Bottom 0.508: J9.7 47.73,18.77 45.53,16.57 43.81,16.57 43.31,16.07 43.31,13.46 42.67,12.83 J3.00
RX_CAN  (via drill 0.3 pad 0.61)
  Top 0.152: D6.- 35.94,3.87 35.94,6.48 37.47,8 v37.47,8.26 | U4.4 35.56,29.21 33.66,27.3 33.66,24.77 32.51,23.62 v29.97,23.62 28.83,22.48 28.83,20.45 25.04,16.66 v22.8,16.66 | v15.62,13.84 15.95,14.17 16,14.17 17.89,16.07 U2.32
  Bottom 0.152: v37.47,8.26 36.32,9.4 36.32,13.34 35.69,13.97 32.51,13.97 32.26,14.22 32.26,19.56 29.46,22.35 29.46,23.11 v29.97,23.62 | v22.8,16.66 22.77,16.64 18.54,16.64 15.75,13.84 v15.62,13.84
RXD
  Top 0.152: U2.25 14.39,17.19 14.1,16.89 9.27,16.89 8,18.16 8,28.68 J12.9
  Bottom 0.152: J11.2 34.02,38.47 32.38,36.83 23.24,36.83 21.72,35.31 7.62,35.31 5.84,33.53 J12.9
SCK  (via drill 0.3 pad 0.61)
  Top 0.152: J8.2 24.38,4.83 22.86,6.35 21.21,6.35 19.94,7.62 19.94,10.79 20.7,11.56 20.7,12.95 v20.64,13.02 | U2.2 19.39,24.86 19.84,25.3 23.09,25.3 23.5,24.89 v23.5,24
  Bottom 0.152: v20.64,13.02 20.64,15.11 21.3,15.77 23.52,15.77 24,16.26 24,20.32 22.48,21.84 22.48,22.61 23.5,23.62 v23.5,24
SCL  (via drill 0.3 pad 0.61)
  Top 0.152: J12.6 5.84,24 4.45,25.4 4.45,35.31 v3.81,35.94 | U2.22 9.39,19.08 8.91,19.56 8.91,23.52 v9.14,23.75
  Bottom 0.152: J10.1 21.67,35.94 v3.81,35.94 | v9.14,23.75 6.38,23.75 J12.6
SDA  (via drill 0.3 pad 0.61)
  Top 0.152: J12.7 5.74,25.75 4.76,26.73 4.76,36.13 v4.32,36.58 | U2.21 9.76,19.58 9.4,19.94 9.4,23.11 9.78,23.5 9.78,24.64 v9.14,25.27
  Bottom 0.152: J10.2 20.3,36.58 v4.32,36.58 | J12.7 8.66,25.75 v9.14,25.27
SWCLK  (via drill 0.3 pad 0.61)
  Top 0.152: U2.45 21.32,22.08 22.23,22.99 27.05,22.99 v27.75,22.29
  Bottom 0.152: J13.3 48.26,3.3 47.37,4.19 44.83,4.19 43.43,5.59 29.59,5.59 28.45,6.73 28.45,13.97 31.11,16.64 31.11,18.54 31.11,18.92 v27.75,22.29
SWDIO  (via drill 0.3 pad 0.61)
  Top 0.152: U2.46 21.39,22.58 22.1,23.29 27.89,23.29 v27.94,23.24
  Bottom 0.152: J13.2 47.5,4.57 45.09,4.57 43.69,5.97 29.72,5.97 28.83,6.86 28.83,13.84 31.5,16.51 31.5,19.3 28.33,22.47 28.33,22.85 v27.94,23.24
TX_CAN  (via drill 0.3 pad 0.61)
  Top 0.152: D7.- 36.01,1.97 36.83,2.79 36.83,6.6 v37.47,7.24 | U4.1 33.91,33.02 33.27,32.38 33.27,25.02 32.51,24.26 28.96,24.26 v28.83,24.13 28.83,23.24 28.32,22.73 28.32,20.57 25.15,17.4 v22.45,17.4 | U2.31 17.39,16 15.88,14.48 v14.99,14.48
  Bottom 0.152: v28.83,24.13 29.08,23.88 29.08,22.23 31.88,19.43 31.88,13.97 32.26,13.59 35.43,13.59 35.94,13.08 35.94,8.76 v37.47,7.24 | v22.45,17.4 20.83,17.4 20.7,17.4 17.91,17.4 v14.99,14.48
TXD
  Top 0.152: U2.26 14.89,16.72 14.73,16.56 8.97,16.56 7.62,17.91 7.62,26.52 J12.8
  Bottom 0.152: J11.1 35.94,38.48 33.66,36.2 23.24,36.2 21.72,34.67 7.62,34.67 7.15,34.2 7.15,29.64 5.84,28.33 J12.8
USB+
  Top 0.152: J1.3 13.17,6.45 13.02,6.6 13.02,6.92 18.78,12.69 18.78,16.24 18.89,16.36 U2.34
USB-
  Top 0.152: J1.2 12.52,6.42 12.64,6.54 12.64,7.05 18.48,12.89 18.48,16.32 18.41,16.38 18.39,16.4 U2.33
VCC_5V  (via drill 0.3 pad 0.61)
  Top 0.203: D2.+ 5.71,7.37 4.7,7.37 3.3,8.76 3.3,10.41 | 3.3,10.41 3.17,10.54 3.17,10.67 3.3,10.54 3.3,10.41
  Top 0.508: U4.5 v42.42,29.21
  Top 0.61: v34.29,29.46 C4.1 34.42,30.48 U4.3 | R13.2 v34.67,24.38 | 27.94,36.7 27.94,35.81 | v27.94,30.73 27.94,35.81 | J10.3 21.99,36.7 27.05,36.7 | 27.05,36.7 27.94,36.7 | 27.94,36.7 28.83,36.7 | J11.3 30.24,36.7 28.96,36.7 28.83,36.7 | 27.94,35.81 27.05,36.7 | 27.94,35.81 28.83,36.7
  Bottom 0.61: 27.69,29.46 v34.29,29.46 34.54,29.21 34.67,29.21 | v42.42,29.21 35.18,29.21 | 35.18,29.21 34.67,29.21 | v34.67,24.38 34.67,28.7 | 34.67,28.7 34.67,29.21 | 34.67,28.7 35.18,29.21
  other vias: 12.57,12.95 11.94,12.95 11.3,12.95 10.67,12.95 23.88,12.95 24.51,13.72 24.51,12.95 23.88,13.72 27.94,30.1 26.92,30.1 26.92,30.73
  pour Top (isolate 0.254, no thermals): 12.57,11.68 10.54,11.68 9.4,10.54 9.4,7.75 8.89,7.24 2.54,7.24 2.03,7.75 2.03,10.41 2.92,11.3 3.56,11.3 4.06,10.79 4.06,9.78 4.57,9.27 6.73,9.27 7.24,9.78 7.24,11.94 8.64,13.34 12.83,13.34 12.95,13.21 12.95,12.06
  pour Bottom (isolate 0.254, no thermals): 15.9,10.11 12.65,13.36 10.69,13.36 10.47,13.14 10.47,12.71 14.68,8.51 20.95,8.51 25.02,12.57 26.42,12.57 27.3,13.46 27.3,15.24 27.94,15.88 27.94,20.57 27.3,21.21 27.3,23.5 28.32,24.51 28.32,30.86 27.69,31.5 26.16,31.5 25.4,30.73 25.4,14.22 25.15,13.97 23.24,13.97 22.48,13.21 22.48,12.45 20.07,10.03
  pour Top (isolate 0.254, no thermals): 23.24,13.97 24.77,13.97 25.02,13.72 25.02,12.06 24.77,11.81 22.99,11.81 22.73,12.06 22.73,13.46
  pour Top (isolate 0.254, no thermals): 30.23,31.5 27.05,31.5 26.54,30.99 26.54,30.1 26.92,29.72 28.32,29.72 28.7,30.1 29.72,30.1 30.99,30.1 31.11,30.23 31.11,31.11 30.73,31.5
VIN
  pour Top (isolate 0.254, no thermals): 48.13,25.65 48.64,25.65 50.42,23.88 50.42,16.76 52.96,14.22 52.96,11.56 52.2,10.79 45.47,10.79 41.4,6.73 39.63,6.73 39.16,7.2 39.16,8.91 39.52,9.27 40.64,9.27 43.31,11.94 44.83,13.46 46.86,13.46 47.1,13.46 48.9,15.26 48.9,22.53 47.8,23.62 47.37,23.62 46.99,24 46.99,25.4 47.24,25.65
VIN_12V  (via drill 0.3 pad 0.61)
  Top 0.406: R10.2 v31.62,22.48
  Bottom 0.406: v31.62,22.48 31.62,22.23 33.78,20.07 33.78,16.51 v34.8,15.49
  pour Top (isolate 0.254, no thermals): 39.24,11.3 40.51,11.3 40.89,11.68 40.89,15.49 40.51,15.88 34.16,15.88 33.78,15.49 33.78,14.73 34.16,14.35 36.58,14.35

### Text on the board
tPlace: RST | 120Ω | I2C | GND | 5V | SDA | SCL | GND | 5V | RX | TX | UART | L(D13) | CANL | CANH | GND | D4 | VIN | RX | D5 | TX | D6 | SDA | A3 | SCL | D8 | 12 | A0 | D9 | 10 | A1 | A2 | 11 | GND | 5V | Iout=1A | VIN(7-28V) | RST | SCK | SO | PWR | GND | SI | 3V | GND | SW | CLK | DIO | RX | 3V | TX
bPlace: CANL | CANBed FD M4 | CANH | V1.0 11/11/2020 | longan-labs.cc | GND | VIN | OBD-II | (default) | CAN OPEN